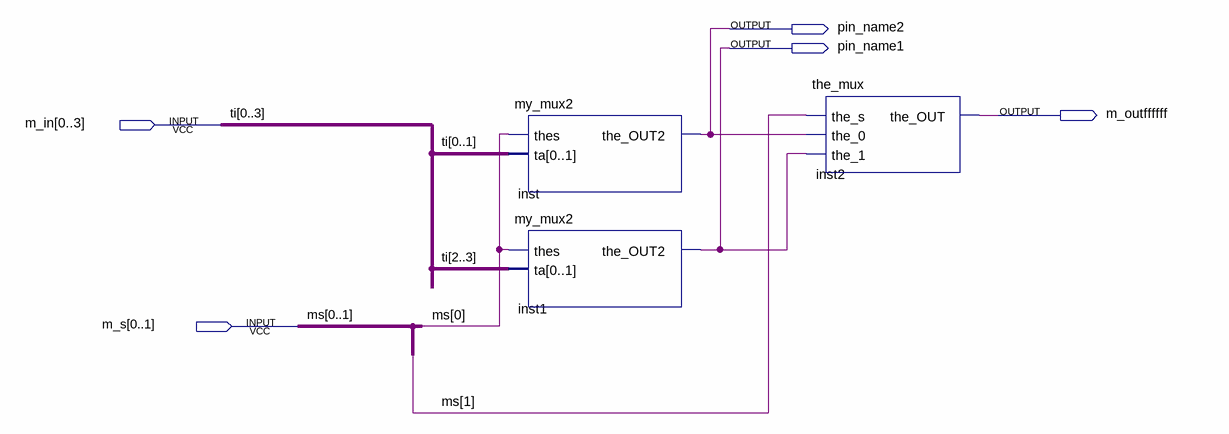
[diagram p0: schematic sheet]
// Quartus schematic my_mux_4_1_bus.bdf as structural Verilog: 3 symbols, 5 pins
module my_mux_4_1_bus (
  input  [0:3] m_in,
  input  [0:1] m_s,
  output pin_name2,
  output pin_name1,
  output m_outffffff
);

  my_mux2 inst (.thes(m_s[0]), .ta(m_in[0:1]), .the_OUT2(pin_name2));
  my_mux2 inst1 (.thes(m_s[0]), .ta(m_in[2:3]), .the_OUT2(pin_name1));
  the_mux inst2 (.the_s(m_s[1]), .the_0(pin_name2), .the_1(pin_name1), .the_OUT(m_outffffff));

  // Other names for the same wires on the sheet: ms[1:0] = {m_s[1], m_s[0]};
  //   ti[3:0] = {m_in[3], m_in[2], m_in[1], m_in[0]}
endmodule
